# Altium schematic sheet PCMS.SchDoc
size A4
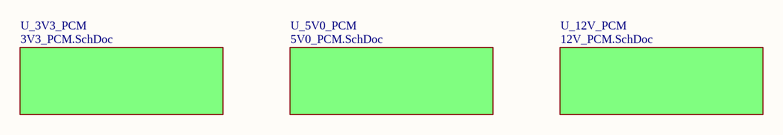
[diagram p0: PCMS.SchDoc]

## Sub-sheets
U_3V3_PCM = 3V3_PCM.SchDoc: no entries
U_5V0_PCM = 5V0_PCM.SchDoc: no entries
U_12V_PCM = 12V_PCM.SchDoc: no entries